# EAGLE design LM3916 (EAGLE 6.5.0)
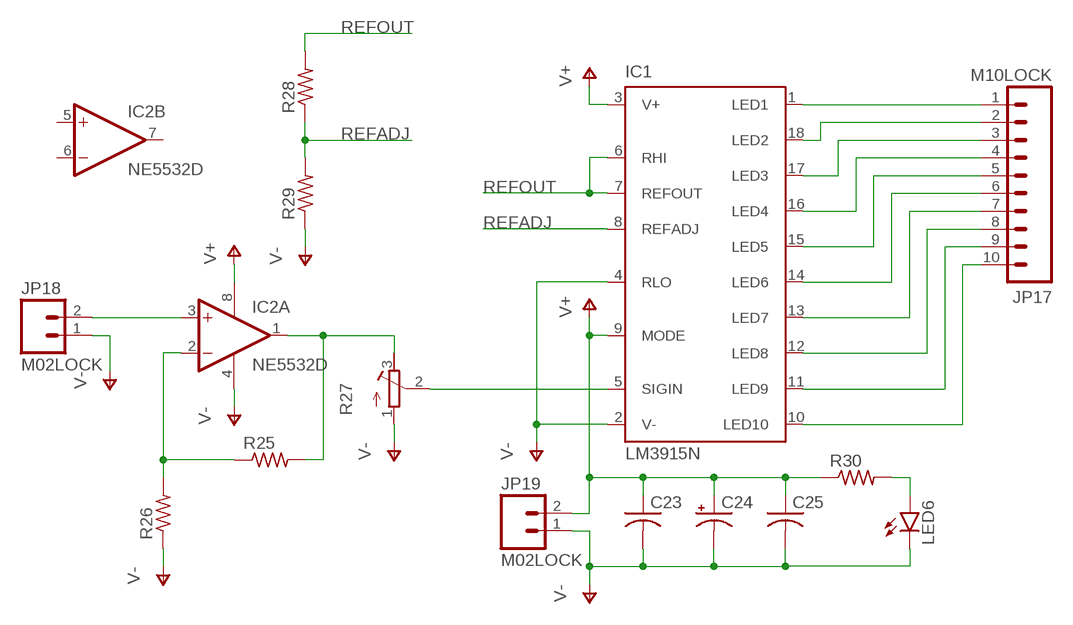
[diagram p0: schematic, sheet 1]

## Parts
C23  C-USC0805  [C0805]
C24  CPOL-USE2-5  [E2-5]
C25  C-USC0805  [C0805]
IC1  LM3915N  [DIL18]
IC2  NE5532D  [SO08]
JP17  M10LOCK  [1X10_LOCK]
JP18  M02LOCK  [1X02_LOCK]
JP19  M02LOCK  [1X02_LOCK]
LED6  LED1206  [LED-1206]
R25  R-US_R0805  [R0805]
R26  R-US_R0805  [R0805]
R27  R-TRIMM64W  [RTRIM64W]
R28  R-US_R0805  [R0805]
R29  R-US_R0805  [R0805]
R30  R-US_R0805  [R0805]

## Nets
N$31: IC1.1(LED1) JP17.1
N$57: IC1.18(LED2) JP17.2
N$58: IC1.17(LED3) JP17.3
N$59: IC1.16(LED4) JP17.4
N$60: IC1.15(LED5) JP17.5
N$61: IC1.14(LED6) JP17.6
N$62: IC1.13(LED7) JP17.7
N$63: IC1.12(LED8) JP17.8
N$64: IC1.11(LED9) JP17.9
N$65: IC1.10(LED10) JP17.10
N$66: IC2.2(A:-IN) R25.1 R26.2
N$67: IC2.1(A:OUT) R25.2 R27.3(E)
N$68: LED6.A R30.2
N$69: IC2.3(A:+IN) JP18.2
N$70: IC1.5(SIGIN) R27.2(S)
REFADJ: IC1.8(REFADJ) R28.1 R29.2
REFOUT: IC1.6(RHI) IC1.7(REFOUT) R28.2
V+: C23.1 C24.+ C25.1 IC1.3(V+) IC1.9(MODE) IC2.8(P:V+) JP19.2 R30.1
V-: C23.2 C24.- C25.2 IC1.2(V-) IC1.4(RLO) IC2.4(P:V-) JP18.1 JP19.1 LED6.C R26.1 R27.1(A) R29.1
Unconnected: IC2.5(B:+IN) IC2.6(B:-IN) IC2.7(B:OUT)

## Library data of the parts
C23 C25 = rcl:C-US: CAPACITOR, American symbol
C24 = rcl:CPOL-US: POLARIZED CAPACITOR, American symbol
IC1 = national-semiconductor:LM391: Dot/Bar Display Driver Source: Data sheet LM3915 <http://www.national.com/ds/LM/LM3915.pdf> Data sheet LM3914 <http://www.national.com/ds/LM/LM3914.pdf>
IC2 = linear:NE5532: AUDIO AMPLIFIER
JP17 = SparkFun-Connectors:M10: Header 10 Standard 10-pin 0.1" header. Use with straight break away headers (SKU : PRT-00116), right angle break away headers (PRT-00553), swiss pins (PRT-00743), machine pins (PRT-00117), and female headers (PRT-00115).
JP18 JP19 = SparkFun-Connectors:M02: Standard 2-pin 0.1" header. Use with - straight break away headers ( PRT-00116) - right angle break away headers (PRT-00553) - swiss pins (PRT-00743) - machine pins (PRT-00117) - female headers (PRT-00115) Molex polarized connector foot print use with: PRT-08233 with associated crimp pins and housings. 2.54_SCREWTERM for use with PRT-10571. 3.5mm Screw Terminal footprints for PRT-08084 5mm Screw Terminal footprints for use with PRT-08432
LED6 = SparkFun-LED:LED: LEDs Standard schematic elements and footprints for 5mm, 3mm, 1206, and 0603 sized LEDs. 5mm - Spark Fun Electronics SKU : COM-00529 (and others)
R25 R26 R28-R30 = rcl:R-US_: RESISTOR, American symbol
R27 = rcl:R-TRIMM: Trimm resistor

## Board
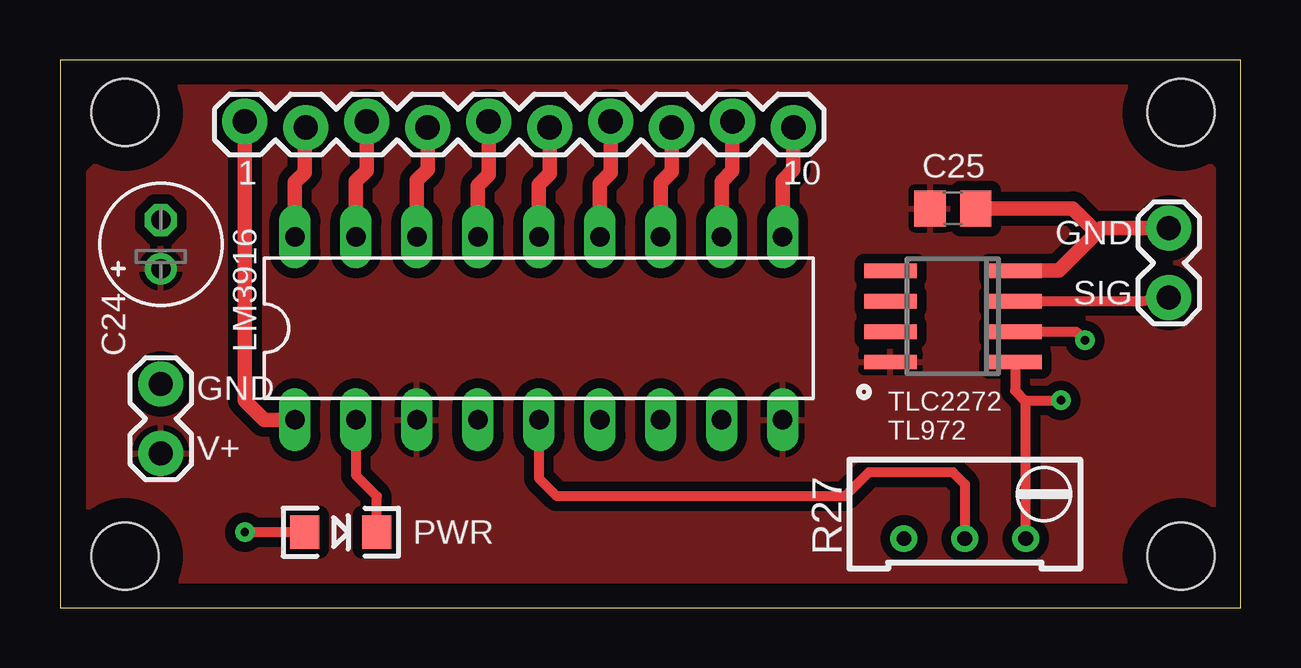
[diagram p1: board, top side]
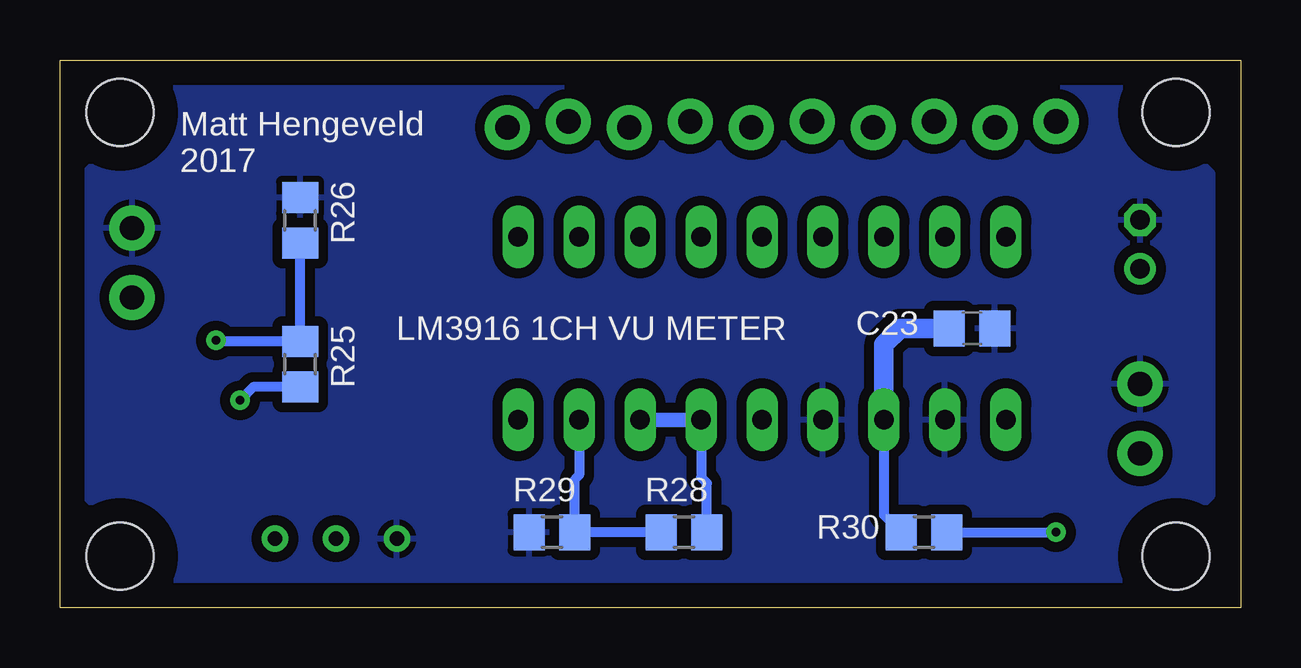
[diagram p2: board, bottom side, seen from below]

Size 49.2 x 22.84 mm. Coordinates in mm from the lower left corner, seen from the top.
Outline: 0,0 49.2,0 49.2,22.84 0,22.84 0,0
Copper layers (1*16): Top 0.035mm / dielectric 1.5mm / Bottom 0.035mm
Design rules "default": minimum track width 10mil, minimum drill 24mil, track to track 8mil, track to pad 8mil, pad to pad 8mil, via to via 8mil, smd to smd 8mil, copper to edge 40mil, drill to drill 8mil, minimum pad ring 10mil, minimum via ring 8mil, stop-mask expansion 4mil, vias tented up to drill 0mil, thermal gap 10mil
Holes 2.8 mm at 2.7,2.15 46.7,2.15 46.7,20.65 2.7,20.65

### Footprints (pad centres in the part's own frame; a part is rotated, then mirrored left to right if it is on the bottom)
C0805 = smd 1.3 x 1.5: 1 -0.95,0; 2 0.95,0
E2-5 = drill 0.813 pad 1.27: + -1.016,0 | drill 0.813 pad 1.27 octagon: - 1.016,0
DIL18 = drill 0.813 long: 1 -10.16,-3.81; 2 -7.62,-3.81; 3 -5.08,-3.81; 4 -2.54,-3.81; 5 0,-3.81; 6 2.54,-3.81; 7 5.08,-3.81; 8 7.62,-3.81; 9 10.16,-3.81; 10 10.16,3.81; 11 7.62,3.81; 12 5.08,3.81; 13 2.54,3.81; 14 0,3.81; 15 -2.54,3.81; 16 -5.08,3.81; 17 -7.62,3.81; 18 -10.16,3.81
SO08 = smd 0.6 x 2.2: 1 -1.905,-2.6; 2 -0.635,-2.6; 3 0.635,-2.6; 4 1.905,-2.6; 5 1.905,2.6; 6 0.635,2.6; 7 -0.635,2.6; 8 -1.905,2.6
1X10_LOCK = drill 1.016 pad 1.88: 1 0,0.127; 2 2.54,-0.127; 3 5.08,0.127; 4 7.62,-0.127; 5 10.16,0.127; 6 12.7,-0.127; 7 15.24,0.127; 8 17.78,-0.127; 9 20.32,0.127; 10 22.86,-0.127
1X02_LOCK = drill 1.016 pad 1.88: 1 -0.178,0; 2 2.718,0
LED-1206 = smd 1.2 x 1.4: A -1.5,0; C 1.5,0
R0805 = smd 1.3 x 1.5: 1 -0.95,0; 2 0.95,0
RTRIM64W = drill 0.61: 1 1.27,-2.54; 2 1.27,0; 3 1.27,2.54

### Placement (x,y rotation side)
C23  11.2,11.65 0 bottom
C24  4.2,15.15 90 top
C25  37.2,16.65 0 top
IC1  19.95,11.65 0 top
IC2  37.2,12.15 90 top
JP17  7.7,20.15 0 top
JP18  46.2,15.65 270 top
JP19  4.2,9.15 270 top
LED6  11.7,3.15 0 top
R25  39.2,10.15 270 bottom
R26  39.2,16.15 270 bottom
R27  37.7,4.15 270 top
R28  23.2,3.15 0 bottom
R29  28.7,3.15 0 bottom
R30  13.2,3.15 0 bottom

### Tracks (layer width: path | path; a pad name or v marks a point on that pad's centre or on a via)
N$31
  Top 0.61: JP17.1 7.7,8.65 8.51,7.84 IC1.1
N$57
  Top 0.61: IC1.18 9.79,17.74 10.2,18.15 10.2,19.98 JP17.2
N$58
  Top 0.61: IC1.17 12.33,17.78 12.78,18.23 JP17.3
N$59
  Top 0.61: IC1.16 14.87,17.82 15.32,18.27 JP17.4
N$60
  Top 0.61: IC1.15 17.41,17.61 17.86,18.06 JP17.5
N$61
  Top 0.61: IC1.14 19.95,17.65 20.4,18.1 JP17.6
N$62
  Top 0.61: IC1.13 22.49,17.69 22.94,18.14 JP17.7
N$63
  Top 0.61: IC1.12 25.03,17.73 25.48,18.18 JP17.8
N$64
  Top 0.61: IC1.11 27.57,17.77 28.02,18.22 JP17.9
N$65
  Top 0.61: IC1.10 30.11,17.81 30.56,18.26 JP17.10
N$66  (via drill 0.35 pad 0.81)
  Top 0.406: IC2.2 42.34,11.52 v42.7,11.15
  Bottom 0.406: R26.2 R25.1 42.65,11.1 v42.7,11.15
N$67  (via drill 0.35 pad 0.81)
  Top 0.406: IC2.1 39.8,9.05 40.2,8.65 | 40.2,8.65 v41.7,8.65 | R27.3 40.24,8.61 40.2,8.65
  Bottom 0.406: R25.2 41.15,9.2 v41.7,8.65
N$68  (via drill 0.35 pad 0.81)
  Top 0.406: LED6.A v7.7,3.15
  Bottom 0.406: R30.2 v7.7,3.15
N$69
  Top 0.406: IC2.3 45.05,12.79 JP18.2
N$70
  Top 0.406: IC1.5 19.95,5.4 20.7,4.65 32.7,4.65 33.7,5.65 37.2,5.65 37.7,5.15 R27.2
REFADJ
  Bottom 0.406: R28.1 R29.2 27.75,5.35 27.57,5.53 IC1.8
REFOUT
  Bottom 0.406: R28.2 22.25,5.2 22.49,5.44 IC1.6
  Bottom 0.61: IC1.6 IC1.7
V+
  Bottom 0.406: IC1.3 14.87,3.87 R30.1
  Bottom 0.813: C23.1 14.2,11.65 14.87,10.98 IC1.3
  pour Top (isolate 0.406): 44.2,22.15 5.2,22.15 1.2,18.15 1.2,4.15 4.2,1.15 45.2,1.15 48.2,4.15 48.2,18.15
V-
  Top 0.406: 43.2,15.65 43.38,15.83 | LED6.C 13.2,4.65 12.33,5.52 IC1.2
  Top 0.61: IC2.4 41.6,14.05 43.2,15.65 42.2,16.65 C25.2 | JP18.1 43.38,15.83
  pour Bottom (isolate 0.406): 44.2,22.15 5.2,22.15 1.2,18.15 1.2,4.65 4.7,1.15 44.7,1.15 48.2,4.65 48.2,18.15

### Text on the board
tPlace: 1 | 10 | GND | SIG | LM3916 | GND | TLC2272 / TL972 | V+ | PWR
bPlace: Matt Hengeveld / 2017 | LM3916 1CH VU METER